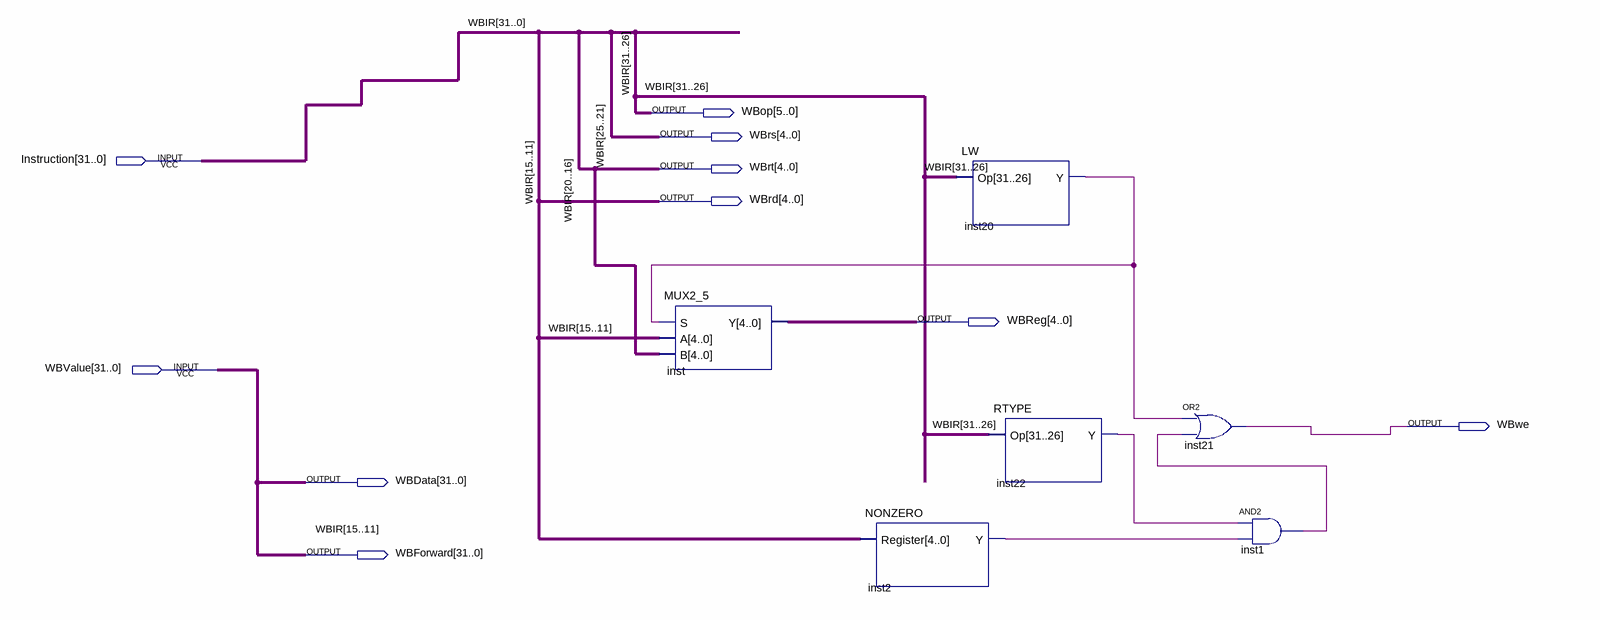
[diagram p0: schematic sheet]
// Quartus schematic WB.bdf as structural Verilog: 6 symbols, 10 pins
module WB (
  input  [31:0] Instruction,
  input  [31:0] WBValue,
  output [5:0] WBop,
  output [4:0] WBrs,
  output [4:0] WBrt,
  output [4:0] WBrd,
  output [4:0] WBReg,
  output WBwe,
  output [31:0] WBData,
  output [31:0] WBForward
);

  wire inst1_out, inst2_y, inst20_y, inst22_y;

  MUX2_5 inst (.S(inst20_y), .A(Instruction[15:11]), .B(Instruction[20:16]), .Y(WBReg));
  NONZERO inst2 (.Register(Instruction[15:11]), .Y(inst2_y));
  LW inst20 (.Op(Instruction[31:26]), .Y(inst20_y));
  RTYPE inst22 (.Op(Instruction[31:26]), .Y(inst22_y));
  or inst21 (WBwe, inst20_y, inst1_out);
  and inst1 (inst1_out, inst22_y, inst2_y);

  assign WBData = WBValue;
  assign WBForward = WBValue;
  assign WBop = Instruction[31:26];
  assign WBrd = Instruction[15:11];
  assign WBrs = Instruction[25:21];
  assign WBrt = Instruction[20:16];

  // Other names for the same wires on the sheet: WBIR[31:0] = Instruction
endmodule
